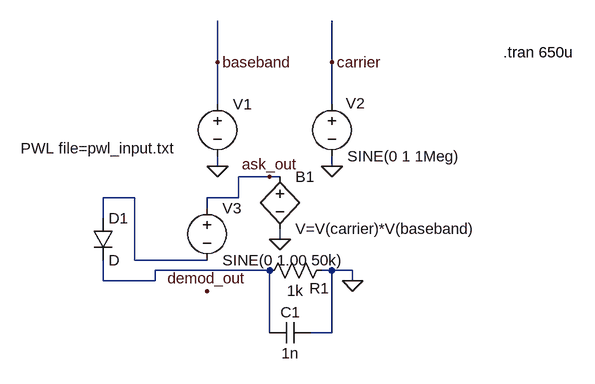
[diagram p0: schematic ask_modem.asc]
ask_modem.asc, the LTspice schematic file:
Version 4.1
SHEET 1 880 680
WIRE 80 64 80 0
WIRE 256 64 256 0
WIRE 80 128 80 64
WIRE 256 128 256 64
WIRE 80 224 80 208
WIRE 256 224 256 208
WIRE 160 240 112 240
WIRE 176 240 160 240
WIRE -48 272 -96 272
WIRE 112 272 112 240
WIRE 112 272 64 272
WIRE 64 288 64 272
WIRE -96 304 -96 272
WIRE 176 336 176 320
WIRE -48 368 -48 272
WIRE 64 368 -48 368
WIRE 160 384 -16 384
WIRE 256 384 240 384
WIRE 288 384 256 384
WIRE -96 400 -96 368
WIRE -16 400 -16 384
WIRE -16 400 -96 400
WIRE 288 400 288 384
WIRE 160 480 160 384
WIRE 256 480 256 384
WIRE 256 480 224 480
FLAG 80 224 0
FLAG 256 224 0
FLAG 176 336 0
FLAG 288 400 0
FLAG 80 64 baseband
FLAG 256 64 carrier
FLAG 64 416 demod_out
FLAG 160 240 ask_out
SYMBOL voltage 80 112 R0
WINDOW 3 -303 84 Left 2
WINDOW 123 0 0 Left 0
WINDOW 39 0 0 Left 0
SYMATTR Value PWL file=pwl_input.txt
SYMATTR InstName V1
SYMBOL voltage 256 112 R0
WINDOW 0 22 15 Left 2
WINDOW 123 0 0 Left 0
WINDOW 39 0 0 Left 0
SYMATTR InstName V2
SYMATTR Value SINE(0 1 1Meg)
SYMBOL bv 176 224 R0
SYMATTR InstName B1
SYMATTR Value V=V(carrier)*V(baseband)
SYMBOL diode -112 304 R0
SYMATTR InstName D1
SYMBOL res 256 368 R90
WINDOW 0 59 19 VBottom 2
WINDOW 3 32 56 VTop 2
SYMATTR InstName R1
SYMATTR Value 1k
SYMBOL cap 224 464 R90
WINDOW 0 0 32 VBottom 2
WINDOW 3 32 32 VTop 2
SYMATTR InstName C1
SYMATTR Value 1n
SYMBOL voltage 64 272 R0
WINDOW 123 0 0 Left 0
WINDOW 39 0 0 Left 0
SYMATTR InstName V3
SYMATTR Value SINE(0 1.00 50k)
TEXT 520 48 Left 2 !.tran 650u

The netlist it stands for:
* ask_modem.asc
V1 baseband 0 PWL file=pwl_input.txt
V2 carrier 0 SINE(0 1 1Meg)
B1 ask_out 0 V=V(carrier)*V(baseband)
D1 N001 N002 D
R1 0 N002 1k
C1 0 N002 1n
V3 ask_out N001 SINE(0 1.00 50k)
.model D D
.lib standard.dio
.tran 650u
.backanno
.end